# Altium schematic sheet Extra.SchDoc
size A4; SheetNumber: 2; SheetTotal: 2
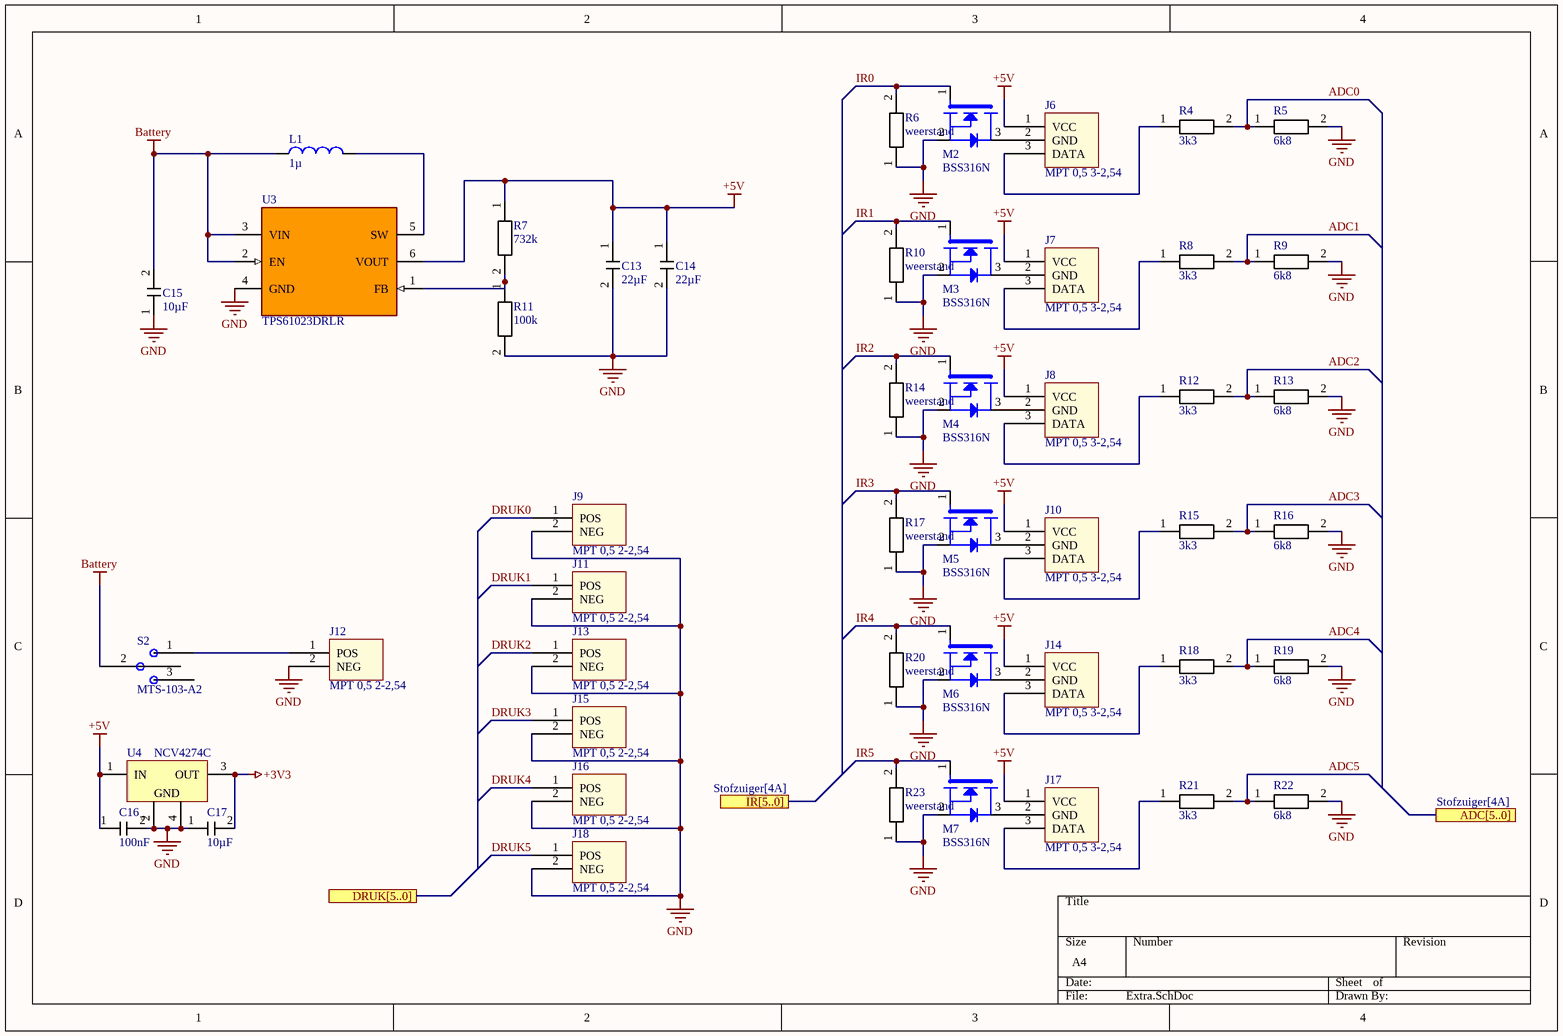
[diagram p0: Extra.SchDoc]

## Parts
C13  22µF  [0603]
C14  22µF  [0603]
C15  10µF  [0603]
C16  100nF  [0603]
C17  10µF  [0603]
J6  MPT 0,5 3-2,54  [MPT 0,5 3-2,54]
J7  MPT 0,5 3-2,54  [MPT 0,5 3-2,54]
J8  MPT 0,5 3-2,54  [MPT 0,5 3-2,54]
J9  MPT 0,5 2-2,54  [MPT 0,5 2-2,54]
J10  MPT 0,5 3-2,54  [MPT 0,5 3-2,54]
J11  MPT 0,5 2-2,54  [MPT 0,5 2-2,54]
J12  MPT 0,5 2-2,54  [MPT 0,5 2-2,54]
J13  MPT 0,5 2-2,54  [MPT 0,5 2-2,54]
J14  MPT 0,5 3-2,54  [MPT 0,5 3-2,54]
J15  MPT 0,5 2-2,54  [MPT 0,5 2-2,54]
J16  MPT 0,5 2-2,54  [MPT 0,5 2-2,54]
J17  MPT 0,5 3-2,54  [MPT 0,5 3-2,54]
J18  MPT 0,5 2-2,54  [MPT 0,5 2-2,54]
L1  1µ  [0603]
M2  BSS316N  [BSS316N]
M3  BSS316N  [BSS316N]
M4  BSS316N  [BSS316N]
M5  BSS316N  [BSS316N]
M6  BSS316N  [BSS316N]
M7  BSS316N  [BSS316N]
R4  3k3  [0603]
R5  6k8  [0603]
R6  weerstand  [0603]
R7  732k  [0603]
R8  3k3  [0603]
R9  6k8  [0603]
R10  weerstand  [0603]
R11  100k  [0603]
R12  3k3  [0603]
R13  6k8  [0603]
R14  weerstand  [0603]
R15  3k3  [0603]
R16  6k8  [0603]
R17  weerstand  [0603]
R18  3k3  [0603]
R19  6k8  [0603]
R20  weerstand  [0603]
R21  3k3  [0603]
R22  6k8  [0603]
R23  weerstand  [0603]
S2  MTS-103-A2  [MTS-103-A2]
U3  TPS61023DRLR  [TPS61023DRLR]
U4  NCV4274C  [NCV4274C]

## Ports
ADC[5..0] (see Stofzuiger[4A]), DRUK[5..0] (see Stofzuiger[4A]), IR[5..0] (see Stofzuiger[4A])

## Nets
+3V3: C17.2(G) U4.3(OUT)
+5V: C13.1(G) C14.1(G) C16.1(G) J6.1(VCC) J7.1(VCC) J8.1(VCC) J10.1(VCC) J14.1(VCC) J17.1(VCC) R7.1 U3.6(VOUT) U4.1(IN)
Battery: C15.2(G) L1.1 S2.2 U3.2(EN) U3.3(VIN)
GND: C13.2(G) C14.2(G) C15.1(G) C16.2(G) C17.1(G) J9.2(NEG) J11.2(NEG) J12.2(NEG) J13.2(NEG) J15.2(NEG) J16.2(NEG) J18.2(NEG) M2.2(S) M3.2(S) M4.2(S) M5.2(S) M6.2(S) M7.2(S) R5.2(G) R6.1 R9.2(G) R10.1 R11.2(G) R13.2(G) R14.1 R16.2(G) R17.1 R19.2(G) R20.1 R22.2(G) R23.1 U3.4(GND) U4.2(GND) U4.4(GND)
ADC0: R4.2(G) R5.1
ADC1: R8.2(G) R9.1
ADC2: R12.2(G) R13.1
ADC3: R15.2(G) R16.1
ADC4: R18.2(G) R19.1
ADC5: R21.2(G) R22.1
DRUK0: J9.1(POS)
DRUK1: J11.1(POS)
DRUK2: J13.1(POS)
DRUK3: J15.1(POS)
DRUK4: J16.1(POS)
DRUK5: J18.1(POS)
IR0: M2.1(G) R6.2(G)
IR1: M3.1(G) R10.2(G)
IR2: M4.1(G) R14.2(G)
IR3: M5.1(G) R17.2(G)
IR4: M6.1(G) R20.2(G)
IR5: M7.1(G) R23.2(G)
NetJ6_2: J6.2(GND) M2.3(D)
NetJ6_3: J6.3(DATA) R4.1
NetJ7_2: J7.2(GND) M3.3(D)
NetJ7_3: J7.3(DATA) R8.1
NetJ8_2: J8.2(GND) M4.3(D)
NetJ8_3: J8.3(DATA) R12.1
NetJ10_2: J10.2(GND) M5.3(D)
NetJ10_3: J10.3(DATA) R15.1
NetJ12_1: J12.1(POS) S2.1
NetJ14_2: J14.2(GND) M6.3(D)
NetJ14_3: J14.3(DATA) R18.1
NetJ17_2: J17.2(GND) M7.3(D)
NetJ17_3: J17.3(DATA) R21.1
NetL1_2: L1.2 U3.5(SW)
NetR7_2: R7.2(G) R11.1 U3.1(FB)

Not connected (* = marked no-connect by the designer): S2 3

## Library data of the parts
C13-C17 = cap
L1 = spoel
R4 R5 R7-R9 R11-R13 R15 R16 R18 R19 R21 R22 = weerstand